# Altium schematic sheet LevelShifter.SchDoc
size A4; SheetNumber: 3; SheetTotal: 3
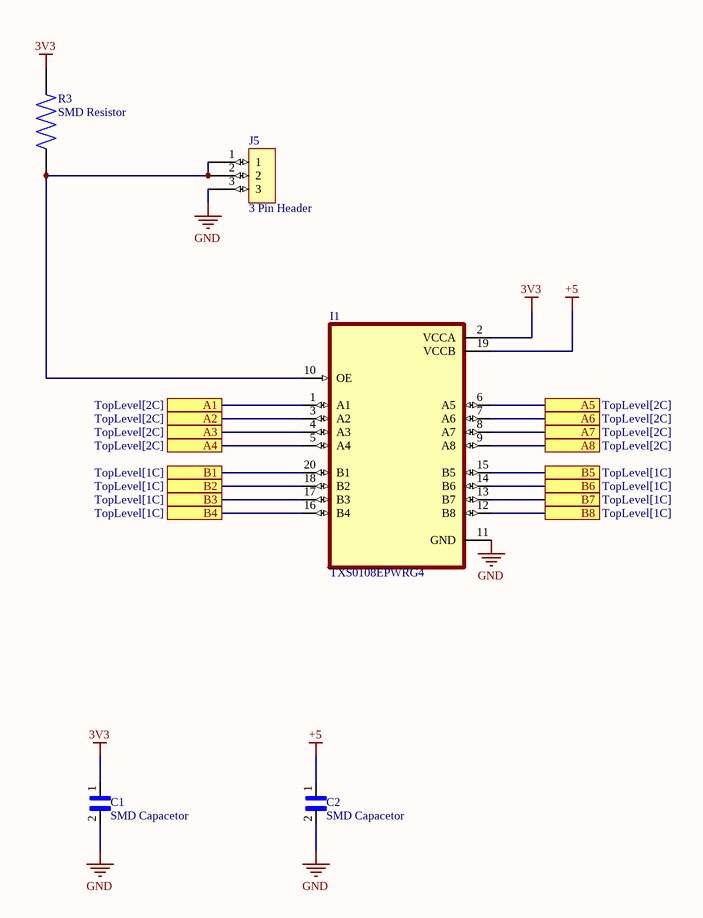
[diagram p0: LevelShifter.SchDoc]

## Parts
C1  SMD Capacetor  [SMD Capacetor-Footprint-1]
C2  SMD Capacetor  [SMD Capacetor-Footprint-1]
I1  TXS0108EPWRG4  [TXS0108EPWRG4-Footprint-1]
J5  3 Pin Header  [3 Pin Header-Footprint-1]
R3  SMD Resistor  [SMD Resistor-Footprint-1]

## Ports
A1 (see TopLevel[2C]), A2 (see TopLevel[2C]), A3 (see TopLevel[2C]), A4 (see TopLevel[2C]), A5 (see TopLevel[2C]), A6 (see TopLevel[2C]), A7 (see TopLevel[2C]), A8 (see TopLevel[2C]), B1 (see TopLevel[1C]), B2 (see TopLevel[1C]), B3 (see TopLevel[1C]), B4 (see TopLevel[1C]), B5 (see TopLevel[1C]), B6 (see TopLevel[1C]), B7 (see TopLevel[1C]), B8 (see TopLevel[1C])

## Nets
3V3: C1.1 I1.2(VCCA) R3.1
+5: C2.1 I1.19(VCCB)
GND: C1.2 C2.2 I1.11(GND) J5.3
A1: I1.1(A1) ; port A1
A2: I1.3(A2) ; port A2
A3: I1.4(A3) ; port A3
A4: I1.5(A4) ; port A4
A5: I1.6(A5) ; port A5
A6: I1.7(A6) ; port A6
A7: I1.8(A7) ; port A7
A8: I1.9(A8) ; port A8
B1: I1.20(B1) ; port B1
B2: I1.18(B2) ; port B2
B3: I1.17(B3) ; port B3
B4: I1.16(B4) ; port B4
B5: I1.15(B5) ; port B5
B6: I1.14(B6) ; port B6
B7: I1.13(B7) ; port B7
B8: I1.12(B8) ; port B8
NetI1_10: I1.10(OE) J5.1 J5.2 R3.2

## Library data of the parts
C1 C2 = CMP-00017-2: Generic SMD Capacetor
I1 = CMP-00042-2: 8-bit bidirectional voltage-level shifter
J5 = CMP-00043-1: 3 Pin Breakout Header
R3 = CMP-00019-2: Generic SMD Resistor